# Altium project DAC_IO.PrjPcb
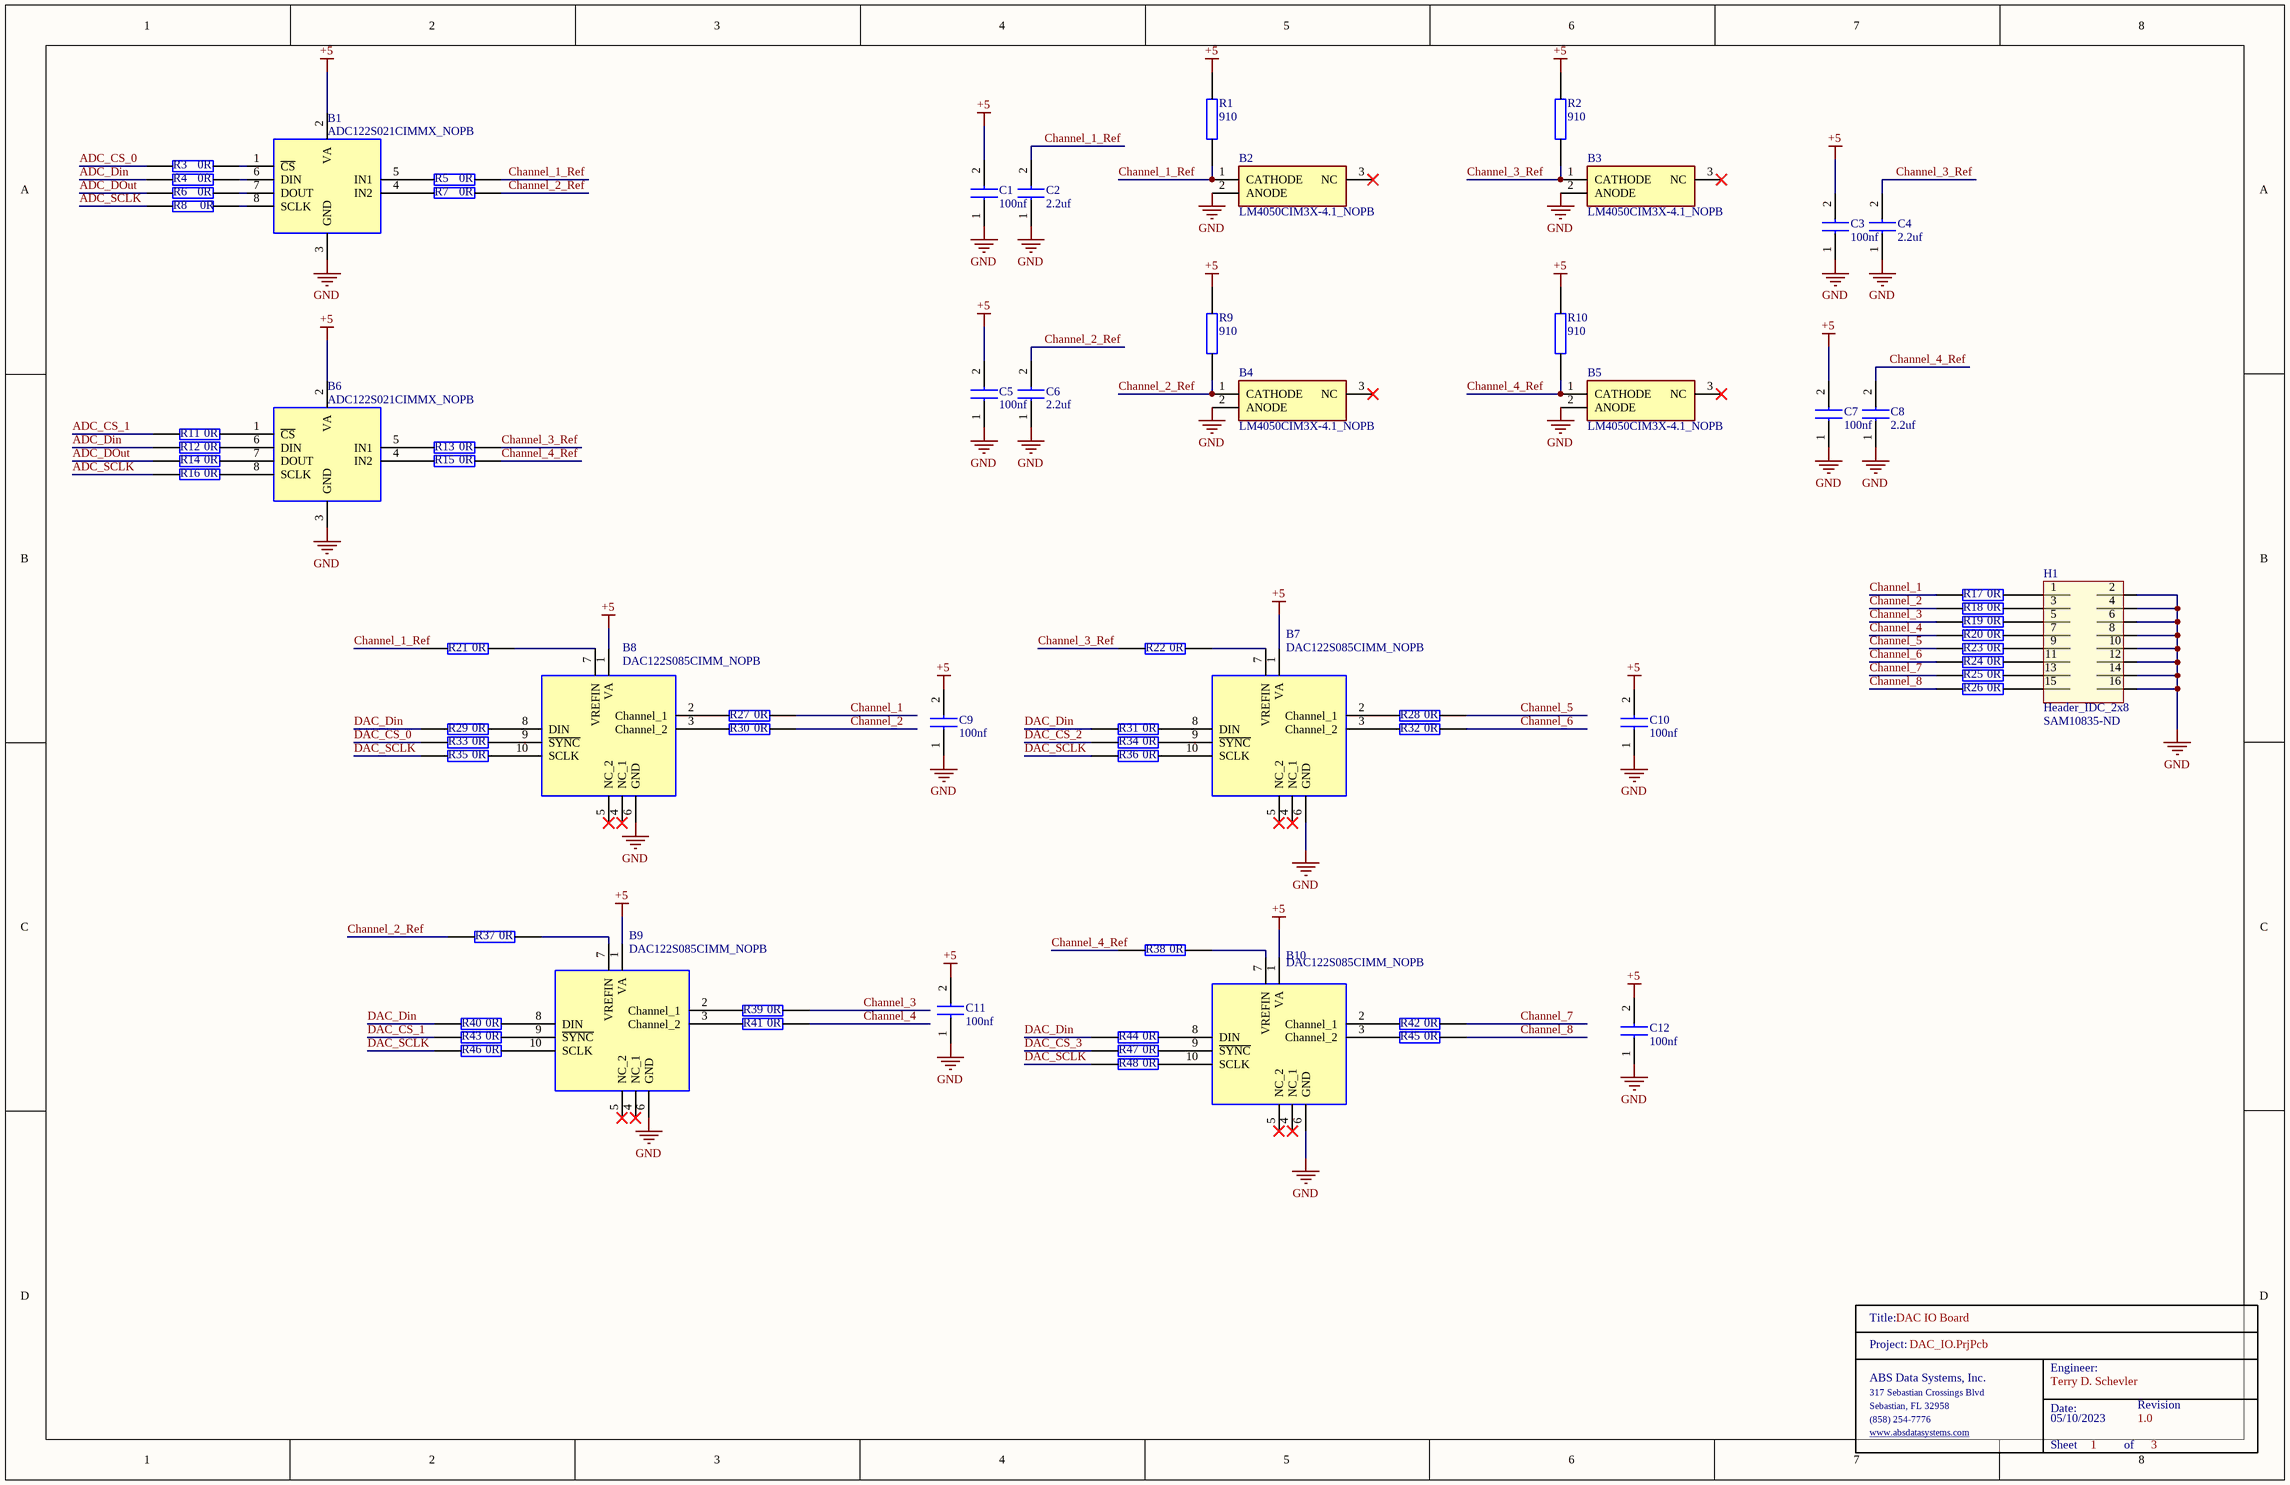
[diagram p0: DAC_IO.SchDoc]
3 sheets, 220 parts. Net scope: global (net labels, ports and power ports of the same name join across sheets).
Board file: DAC_PCB.PcbDoc
Sheets:
  DAC_IO.SchDoc
  DAC_CPU.SchDoc
  DAC_LED_Monitor.SchDoc

## Sheet DAC_IO.SchDoc: DAC IO Board
size Tabloid; Date: 05/10/2023; Engineer: Terry D. Schevler; Revision: 1.0; SheetNumber: 1; SheetTotal: 3

### Parts
B1  ADC122S021CIMMX_NOPB  [SOP65P490X110-8N]
B2  LM4050CIM3X-4.1_NOPB  [SOT95P237X95-3N]
B3  LM4050CIM3X-4.1_NOPB  [SOT95P237X95-3N]
B4  LM4050CIM3X-4.1_NOPB  [SOT95P237X95-3N]
B5  LM4050CIM3X-4.1_NOPB  [SOT95P237X95-3N]
B6  ADC122S021CIMMX_NOPB  [SOP65P490X110-8N]
B7  DAC122S085CIMM_NOPB  [SOP50P490X110-10N]
B8  DAC122S085CIMM_NOPB  [SOP50P490X110-10N]
B9  DAC122S085CIMM_NOPB  [SOP50P490X110-10N]
B10  DAC122S085CIMM_NOPB  [SOP50P490X110-10N]
C1  100nf  [0603]
C2  2.2uf  [0603]
C3  100nf  [0603]
C4  2.2uf  [0603]
C5  100nf  [0603]
C6  2.2uf  [0603]
C7  100nf  [0603]
C8  2.2uf  [0603]
C9  100nf  [0603]
C10  100nf  [0603]
C11  100nf  [0603]
C12  100nf  [0603]
H1  Header_IDC_2x8  Supplier Part Number 1: SAM10835-ND  [HEADER16]
R1  910  [0603]
R2  910  [0603]
R3  0R  [0603]
R4  0R  [0603]
R5  0R  [0603]
R6  0R  [0603]
R7  0R  [0603]
R8  0R  [0603]
R9  910  [0603]
R10  910  [0603]
R11  0R  [0603]
R12  0R  [0603]
R13  0R  [0603]
R14  0R  [0603]
R15  0R  [0603]
R16  0R  [0603]
R17  0R  [0603]
R18  0R  [0603]
R19  0R  [0603]
R20  0R  [0603]
R21  0R  [0603]
R22  0R  [0603]
R23  0R  [0603]
R24  0R  [0603]
R25  0R  [0603]
R26  0R  [0603]
R27  0R  [0603]
R28  0R  [0603]
R29  0R  [0603]
R30  0R  [0603]
R31  0R  [0603]
R32  0R  [0603]
R33  0R  [0603]
R34  0R  [0603]
R35  0R  [0603]
R36  0R  [0603]
R37  0R  [0603]
R38  0R  [0603]
R39  0R  [0603]
R40  0R  [0603]
R41  0R  [0603]
R42  0R  [0603]
R43  0R  [0603]
R44  0R  [0603]
R45  0R  [0603]
R46  0R  [0603]
R47  0R  [0603]
R48  0R  [0603]
TitleBlock_1  TitleBlock  (value not drawn)  (graphical)

### Nets
+5: B1.2(VA) B6.2(VA) B7.1(VA) B8.1(VA) B9.1(VA) B10.1(VA) C1.2 C3.2 C5.2 C7.2 C9.2 C10.2 C11.2 C12.2 R1.1 R2.1 R9.1 R10.1
GND: B1.3(GND) B2.2(ANODE) B3.2(ANODE) B4.2(ANODE) B5.2(ANODE) B6.3(GND) B7.6(GND) B8.6(GND) B9.6(GND) B10.6(GND) C1.1 C2.1 C3.1 C4.1 C5.1 C6.1 C7.1 C8.1 C9.1 C10.1 C11.1 C12.1 H1.2 H1.4 H1.6 H1.8 H1.10 H1.12 H1.14 H1.16
ADC_CS_0: R3.1
ADC_CS_1: R11.1
ADC_Din: R4.1 R12.1
ADC_DOut: R6.1 R14.1
ADC_SCLK: R8.1 R16.1
Channel_1: R17.1 R27.2
Channel_1_Ref: B2.1(CATHODE) C2.2 R1.2 R5.2 R21.1
Channel_2: R18.1 R30.2
Channel_2_Ref: B4.1(CATHODE) C6.2 R7.2 R9.2 R37.1
Channel_3: R19.1 R39.2
Channel_3_Ref: B3.1(CATHODE) C4.2 R2.2 R13.2 R22.1
Channel_4: R20.1 R41.2
Channel_4_Ref: B5.1(CATHODE) C8.2 R10.2 R15.2 R38.1
Channel_5: R23.1 R28.2
Channel_6: R24.1 R32.2
Channel_7: R25.1 R42.2
Channel_8: R26.1 R45.2
DAC_CS_0: R33.1
DAC_CS_1: R43.1
DAC_CS_2: R34.1
DAC_CS_3: R47.1
DAC_Din: R29.1 R31.1 R40.1 R44.1
DAC_SCLK: R35.1 R36.1 R46.1 R48.1
NetB1_1: B1.1(~{CS}) R3.2
NetB1_4: B1.4(IN2) R7.1
NetB1_5: B1.5(IN1) R5.1
NetB1_6: B1.6(DIN) R4.2
NetB1_7: B1.7(DOUT) R6.2
NetB1_8: B1.8(SCLK) R8.2
NetB6_1: B6.1(~{CS}) R11.2
NetB6_4: B6.4(IN2) R15.1
NetB6_5: B6.5(IN1) R13.1
NetB6_6: B6.6(DIN) R12.2
NetB6_7: B6.7(DOUT) R14.2
NetB6_8: B6.8(SCLK) R16.2
NetB7_2: B7.2(Channel_1) R28.1
NetB7_3: B7.3(Channel_2) R32.1
NetB7_7: B7.7(VREFIN) R22.2
NetB7_8: B7.8(DIN) R31.2
NetB7_9: B7.9(~{SYNC}) R34.2
NetB7_10: B7.10(SCLK) R36.2
NetB8_2: B8.2(Channel_1) R27.1
NetB8_3: B8.3(Channel_2) R30.1
NetB8_7: B8.7(VREFIN) R21.2
NetB8_8: B8.8(DIN) R29.2
NetB8_9: B8.9(~{SYNC}) R33.2
NetB8_10: B8.10(SCLK) R35.2
NetB9_2: B9.2(Channel_1) R39.1
NetB9_3: B9.3(Channel_2) R41.1
NetB9_7: B9.7(VREFIN) R37.2
NetB9_8: B9.8(DIN) R40.2
NetB9_9: B9.9(~{SYNC}) R43.2
NetB9_10: B9.10(SCLK) R46.2
NetB10_2: B10.2(Channel_1) R42.1
NetB10_3: B10.3(Channel_2) R45.1
NetB10_7: B10.7(VREFIN) R38.2
NetB10_8: B10.8(DIN) R44.2
NetB10_9: B10.9(~{SYNC}) R47.2
NetB10_10: B10.10(SCLK) R48.2
NetH1_1: H1.1 R17.2
NetH1_3: H1.3 R18.2
NetH1_5: H1.5 R19.2
NetH1_7: H1.7 R20.2
NetH1_9: H1.9 R23.2
NetH1_11: H1.11 R24.2
NetH1_13: H1.13 R25.2
NetH1_15: H1.15 R26.2

Not connected (* = marked no-connect by the designer): B2 3(NC)*; B3 3(NC)*; B4 3(NC)*; B5 3(NC)*; B7 4(NC_1)* 5(NC_2)*; B8 4(NC_1)* 5(NC_2)*; B9 4(NC_1)* 5(NC_2)*; B10 4(NC_1)* 5(NC_2)*

### Notes on the sheet
- (in symbol TitleBlock) Title:; Project:; Engineer:; ABS Data Systems, Inc.; 317 Sebastian Crossings Blvd; Sebastian, FL 32958; Date:; Revision; (858) 254-7776; www.absdatasystems.com; Sheet; of

### Library data of the parts
B1 B6 = ADC122S021CIMMX_NOPB: 2 Channel, 50 ksps to 200 ksps 12-Bit A/D Converter; Manufacturer_Name: Texas Instruments; Manufacturer_Part_Number: ADC122S021CIMMX/NOPB; Geometry.Height: 1.1mm; Mouser Part Number: 926-A122S021CIMMXNPB; Mouser Price/Stock: https://www.mouser.co.uk/ProductDetail/Texas-Instruments/ADC122S021CIMMX-NOPB/?qs=7X5t%252BdzoRHB2bC7Teu8H3A%3D%3D; Datasheet Link: http://www.ti.com/lit/gpn/ADC122S021
B2-B5 = LM4050CIM3X-4.1_NOPB: 50ppm/C Precision Micropower Shunt Voltage Reference; Manufacturer_Name: Texas Instruments; Manufacturer_Part_Number: LM4050CIM3X-4.1/NOPB; Geometry.Height: 0.95mm; Mouser Part Number: 926-LM4050CIM3X41NPB; Mouser Price/Stock: https://www.mouser.co.uk/ProductDetail/Texas-Instruments/LM4050CIM3X-4.1-NOPB?qs=QbsRYf82W3Em%2F29oRlpByg%3D%3D; Datasheet Link: http://www.ti.com/lit/gpn/lm4050-n
B7-B10 = DAC122S085CIMM_NOPB: 12-Bit Micro Power DUAL Digital-to-Analog Converter with Rail-to-Rail Output; Manufacturer_Name: Texas Instruments; Manufacturer_Part_Number: DAC122S085CIMM/NOPB; Geometry.Height: 1.1mm; Mouser Part Number: 926-DAC122S085CIMMNO; Mouser Price/Stock: https://www.mouser.co.uk/ProductDetail/Texas-Instruments/DAC122S085CIMM-NOPB/?qs=7X5t%252BdzoRHCSswOz%252BE6yGA%3D%3D; Datasheet Link: http://www.ti.com/lit/gpn/dac122s085
C1 C3 C5 C7 C9-C12 = CL10B104JB8NNNC: Samsung Electro-Mechanics 0603 100nf
C2 C4 C6 C8 = CL10B225KP8NNNC: Samsung Electro-Mechanics 0603 2.2uf
H1 = Header_IDC_2x8: 16 Pin 2x8 Through Hold IDC Connector; Manufacturer: Samtec; Manufacturer Part Number: TST-108-01-G-D; Number of Contacts: 16; Gender: Male; Connector Type: Male Pin; Pitch: 2.54mm; Row Spacing: 0.1inch; Supplier 1: Digi-Key; RoHS: Yes; Category: Headers and Wire Housings; Stock 1: 227; Pricing 1: 1=2.85000, 10=2.73600, 100=2.28000, 500=1.93800, 1000=1.65300, 5000=1.48200 (USD); Mount: Through Hole; Contact Plating: Gold; Contact Material: Bronze; Housing Material: Polyester; Housing Color: Black; Color: Black; Min Operating Temperature: -55°C; Max Operating Temperature: 125°C; Number of Rows: 2; Termination: Solder; Packaging: Rail/Tube; Orientation: Straight; Number of Positions: 16; Length: 27.94mm; Depth: 9.27mm; Contact Mating Length: 0.25inch; REACH SVHC: No SVHC; ComponentLink1URL: https://datasheet.ciiva.com/739/tst-mkt-739845.pdf?src-supplier=Digi-Key; ComponentLink1Description: https://datasheet.ciiva.com/739/tst-mkt-739845.pdf?src-supplier=Digi-Key; ComponentLink2URL: https://datasheet.ciiva.com/10018/htst-10018510.pdf?src-supplier=Avnet; ComponentLink2Description: https://datasheet.ciiva.com/10018/htst-10018510.pdf?src-supplier=Avnet
R1 R2 R9 R10 = RT0603BRC07910RL: YAGEO 0603 910 ohm; Manufacturer_Name: KEMET; Manufacturer_Part_Number: RC0603JR-070RL; Geometry.Height: 0.55mm; Mouser Part Number: 603-RC0603JR-070RL; Mouser Price/Stock: https://www.mouser.co.uk/ProductDetail/YAGEO/RC0603JR-070RL?qs=2cAdsCoAWRGWyPcuXgGiXQ%3D%3D; Datasheet Link: https://datasheet.datasheetarchive.com/originals/distributors/Datasheets_SAMA/902f9e387b938f871d31120f5fc1d65e.pdf
R3-R8 R11-R48 = RC0603JR-070RL: YAGEO 0603 0 ohm; Manufacturer_Name: KEMET; Geometry.Height: 0.55mm; Mouser Part Number: 603-RC0603JR-070RL; Mouser Price/Stock: https://www.mouser.co.uk/ProductDetail/YAGEO/RC0603JR-070RL?qs=2cAdsCoAWRGWyPcuXgGiXQ%3D%3D; Manufacturer_Part_Number: RC0603JR-070RL; Datasheet Link: https://datasheet.datasheetarchive.com/originals/distributors/Datasheets_SAMA/902f9e387b938f871d31120f5fc1d65e.pdf

## Sheet DAC_CPU.SchDoc: DAC CPU Board
size Tabloid; Date: 06/07/2023; Engineer: Terry D. Schevker; Revision: 1.0; SheetNumber: 2; SheetTotal: 3
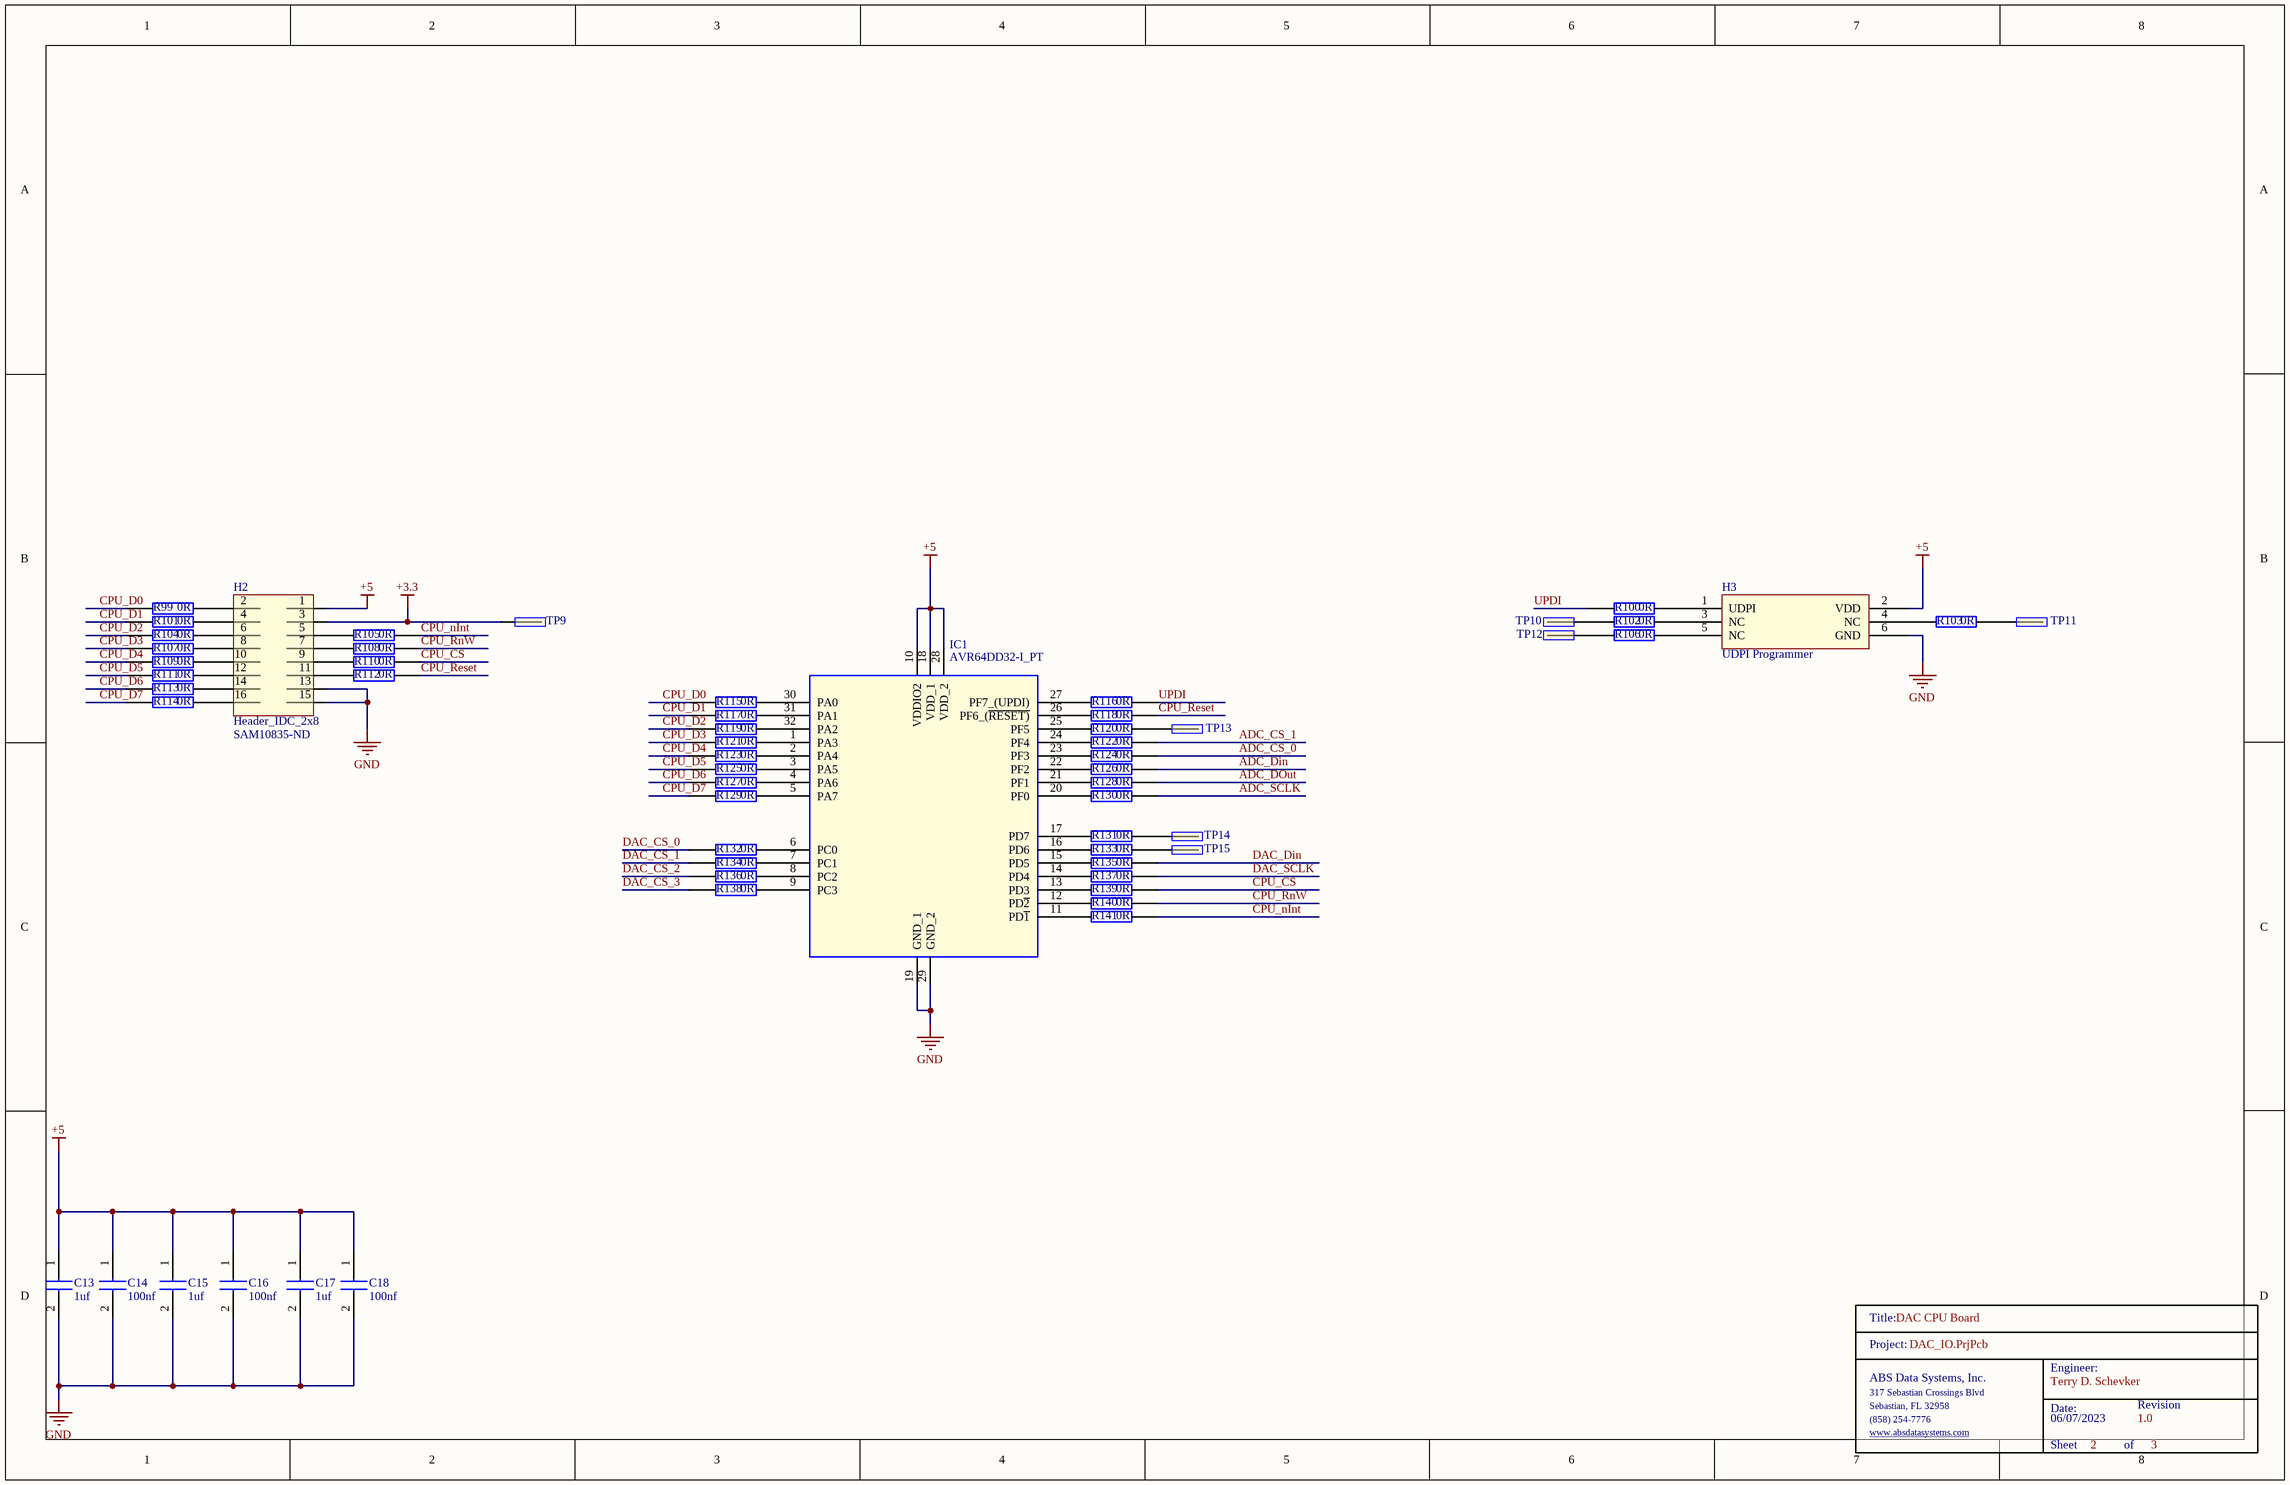
[diagram p1: DAC_CPU.SchDoc]

### Parts
C13  1uf  [0603]
C14  100nf  [0603]
C15  1uf  [0603]
C16  100nf  [0603]
C17  1uf  [0603]
C18  100nf  [0603]
H2  Header_IDC_2x8  Supplier Part Number 1: SAM10835-ND  [HEADER16]
H3  UDPI Programmer  [HDR2X3]
IC1  AVR64DD32-I_PT  [QFP80P900X900X120-32N]
R99  0R  [0603]
R100  0R  [0603]
R101  0R  [0603]
R102  0R  [0603]
R103  0R  [0603]
R104  0R  [0603]
R105  0R  [0603]
R106  0R  [0603]
R107  0R  [0603]
R108  0R  [0603]
R109  0R  [0603]
R110  0R  [0603]
R111  0R  [0603]
R112  0R  [0603]
R113  0R  [0603]
R114  0R  [0603]
R115  0R  [0603]
R116  0R  [0603]
R117  0R  [0603]
R118  0R  [0603]
R119  0R  [0603]
R120  0R  [0603]
R121  0R  [0603]
R122  0R  [0603]
R123  0R  [0603]
R124  0R  [0603]
R125  0R  [0603]
R126  0R  [0603]
R127  0R  [0603]
R128  0R  [0603]
R129  0R  [0603]
R130  0R  [0603]
R131  0R  [0603]
R132  0R  [0603]
R133  0R  [0603]
R134  0R  [0603]
R135  0R  [0603]
R136  0R  [0603]
R137  0R  [0603]
R138  0R  [0603]
R139  0R  [0603]
R140  0R  [0603]
R141  0R  [0603]
TitleBlock_?  TitleBlock  (value not drawn)  (graphical)
TP9  TP  [TP]  (value not drawn)
TP10  TP  [TP]  (value not drawn)
TP11  TP  [TP]  (value not drawn)
TP12  TP  [TP]  (value not drawn)
TP13  TP  [TP]  (value not drawn)
TP14  TP  [TP]  (value not drawn)
TP15  TP  [TP]  (value not drawn)

### Nets
+3.3: H2.3 TP9.1
+5: C13.1 C14.1 C15.1 C16.1 C17.1 C18.1 H2.1 H3.2(VDD) IC1.10(VDDIO2) IC1.18(VDD_1) IC1.28(VDD_2)
GND: C13.2 C14.2 C15.2 C16.2 C17.2 C18.2 H2.13 H2.15 H3.6(GND) IC1.19(GND_1) IC1.29(GND_2)
ADC_CS_0: R124.2
ADC_CS_1: R122.2
ADC_Din: R126.2
ADC_DOut: R128.2
ADC_SCLK: R130.2
CPU_CS: R110.2 R139.2
CPU_D0: R99.1 R115.1
CPU_D1: R101.1 R117.1
CPU_D2: R104.1 R119.1
CPU_D3: R107.1 R121.1
CPU_D4: R109.1 R123.1
CPU_D5: R111.1 R125.1
CPU_D6: R113.1 R127.1
CPU_D7: R114.1 R129.1
CPU_nInt: R105.2 R141.2
CPU_Reset: R112.2 R118.2
CPU_RnW: R108.2 R140.2
DAC_CS_0: R132.1
DAC_CS_1: R134.1
DAC_CS_2: R136.1
DAC_CS_3: R138.1
DAC_Din: R135.2
DAC_SCLK: R137.2
UPDI: R100.1 R116.2
NetH2_2: H2.2 R99.2
NetH2_4: H2.4 R101.2
NetH2_5: H2.5 R105.1
NetH2_6: H2.6 R104.2
NetH2_7: H2.7 R108.1
NetH2_8: H2.8 R107.2
NetH2_9: H2.9 R110.1
NetH2_10: H2.10 R109.2
NetH2_11: H2.11 R112.1
NetH2_12: H2.12 R111.2
NetH2_14: H2.14 R113.2
NetH2_16: H2.16 R114.2
NetH3_1: H3.1(UDPI) R100.2
NetH3_3: H3.3(NC) R102.2
NetH3_4: H3.4(NC) R103.1
NetH3_5: H3.5(NC) R106.2
NetIC1_1: IC1.1(PA3) R121.2
NetIC1_2: IC1.2(PA4) R123.2
NetIC1_3: IC1.3(PA5) R125.2
NetIC1_4: IC1.4(PA6) R127.2
NetIC1_5: IC1.5(PA7) R129.2
NetIC1_6: IC1.6(PC0) R132.2
NetIC1_7: IC1.7(PC1) R134.2
NetIC1_8: IC1.8(PC2) R136.2
NetIC1_9: IC1.9(PC3) R138.2
NetIC1_11: IC1.11(PD~{1}) R141.1
NetIC1_12: IC1.12(PD~{2}) R140.1
NetIC1_13: IC1.13(PD3) R139.1
NetIC1_14: IC1.14(PD4) R137.1
NetIC1_15: IC1.15(PD5) R135.1
NetIC1_16: IC1.16(PD6) R133.1
NetIC1_17: IC1.17(PD7) R131.1
NetIC1_20: IC1.20(PF0) R130.1
NetIC1_21: IC1.21(PF1) R128.1
NetIC1_22: IC1.22(PF2) R126.1
NetIC1_23: IC1.23(PF3) R124.1
NetIC1_24: IC1.24(PF4) R122.1
NetIC1_25: IC1.25(PF5) R120.1
NetIC1_26: IC1.26(PF6_(~{RESET)}) R118.1
NetIC1_27: IC1.27(PF7_(UPDI)) R116.1
NetIC1_30: IC1.30(PA0) R115.2
NetIC1_31: IC1.31(PA1) R117.2
NetIC1_32: IC1.32(PA2) R119.2
NetR102_1: R102.1 TP10.1
NetR103_2: R103.2 TP11.1
NetR106_1: R106.1 TP12.1
NetR120_2: R120.2 TP13.1
NetR131_2: R131.2 TP14.1
NetR133_2: R133.2 TP15.1

### Notes on the sheet
- (in symbol TitleBlock) Title:; Project:; Engineer:; ABS Data Systems, Inc.; 317 Sebastian Crossings Blvd; Sebastian, FL 32958; Date:; Revision; (858) 254-7776; www.absdatasystems.com; Sheet; of

### Library data of the parts
C13 C15 C17 = CL10B105KA8NNNL: Samsung Electro-Mechanics 0603 1uf
C14 C16 C18 = CL10B104JB8NNNC: Samsung Electro-Mechanics 0603 100nf
H2 = Header_IDC_2x8: as H1 on sheet DAC_IO; Supplier 1: Digi-Key; RoHS: Yes; Category: Headers and Wire Housings; Stock 1: 227; Pricing 1: 1=2.85000, 10=2.73600, 100=2.28000, 500=1.93800, 1000=1.65300, 5000=1.48200 (USD); Mount: Through Hole; Contact Plating: Gold; Contact Material: Bronze; Housing Material: Polyester; Housing Color: Black; Color: Black; Min Operating Temperature: -55°C; Max Operating Temperature: 125°C; Number of Rows: 2; Termination: Solder; Packaging: Rail/Tube; Orientation: Straight; Number of Positions: 16; Length: 27.94mm; Depth: 9.27mm; Contact Mating Length: 0.25inch; REACH SVHC: No SVHC; ComponentLink1URL: https://datasheet.ciiva.com/739/tst-mkt-739845.pdf?src-supplier=Digi-Key; ComponentLink1Description: https://datasheet.ciiva.com/739/tst-mkt-739845.pdf?src-supplier=Digi-Key; ComponentLink2URL: https://datasheet.ciiva.com/10018/htst-10018510.pdf?src-supplier=Avnet; ComponentLink2Description: https://datasheet.ciiva.com/10018/htst-10018510.pdf?src-supplier=Avnet
H3 = UDPI Programmer: 6 Pin 2X3 Through Hole Header
IC1 = AVR64DD32-I_PT: Integrated Circuit; Manufacturer_Name: Microchip; Manufacturer_Part_Number: AVR64DD32-I/PT | MULTI-VOLTAGE I/O; Datasheet Link: https://www.microchip.com/en-us/product/AVR64DD32; Height: 1.2mm
R99-R141 = RC0603JR-070RL: as R3 on sheet DAC_IO; Mouser Part Number: 603-RC0603JR-070RL; Mouser Price/Stock: https://www.mouser.co.uk/ProductDetail/YAGEO/RC0603JR-070RL?qs=2cAdsCoAWRGWyPcuXgGiXQ%3D%3D; Manufacturer_Part_Number: RC0603JR-070RL; Datasheet Link: https://datasheet.datasheetarchive.com/originals/distributors/Datasheets_SAMA/902f9e387b938f871d31120f5fc1d65e.pdf
TP9-TP15 = TP: Manufacturer: Samtec; Manufacturer Part Number: TST-105-01-G-D; Number of Contacts: 16; Gender: Male; Connector Type: Male Pin; Pitch: 2.54mm; Row Spacing: 0.1inch; Supplier 1: Digi-Key; RoHS: Yes; Category: Headers and Wire Housings; Stock 1: 227; Pricing 1: 1=2.85000, 10=2.73600, 100=2.28000, 500=1.93800, 1000=1.65300, 5000=1.48200 (USD); Mount: Through Hole; Contact Plating: Gold; Contact Material: Bronze; Housing Material: Polyester; Housing Color: Black; Color: Black; Min Operating Temperature: -55°C; Max Operating Temperature: 125°C; Number of Rows: 2; Termination: Solder; Packaging: Rail/Tube; Orientation: Straight; Number of Positions: 16; Length: 27.94mm; Depth: 9.27mm; Contact Mating Length: 0.25inch; REACH SVHC: No SVHC; ComponentLink1URL: https://datasheet.ciiva.com/739/tst-mkt-739845.pdf?src-supplier=Digi-Key; ComponentLink1Description: https://datasheet.ciiva.com/739/tst-mkt-739845.pdf?src-supplier=Digi-Key; ComponentLink2URL: https://datasheet.ciiva.com/10018/htst-10018510.pdf?src-supplier=Avnet; ComponentLink2Description: https://datasheet.ciiva.com/10018/htst-10018510.pdf?src-supplier=Avnet

## Sheet DAC_LED_Monitor.SchDoc: DAC LED Monitor
size Tabloid; Date: 05/10/2023; Engineer: Terry D.  Schevker; Revision: 1.0; SheetNumber: 3; SheetTotal: 3
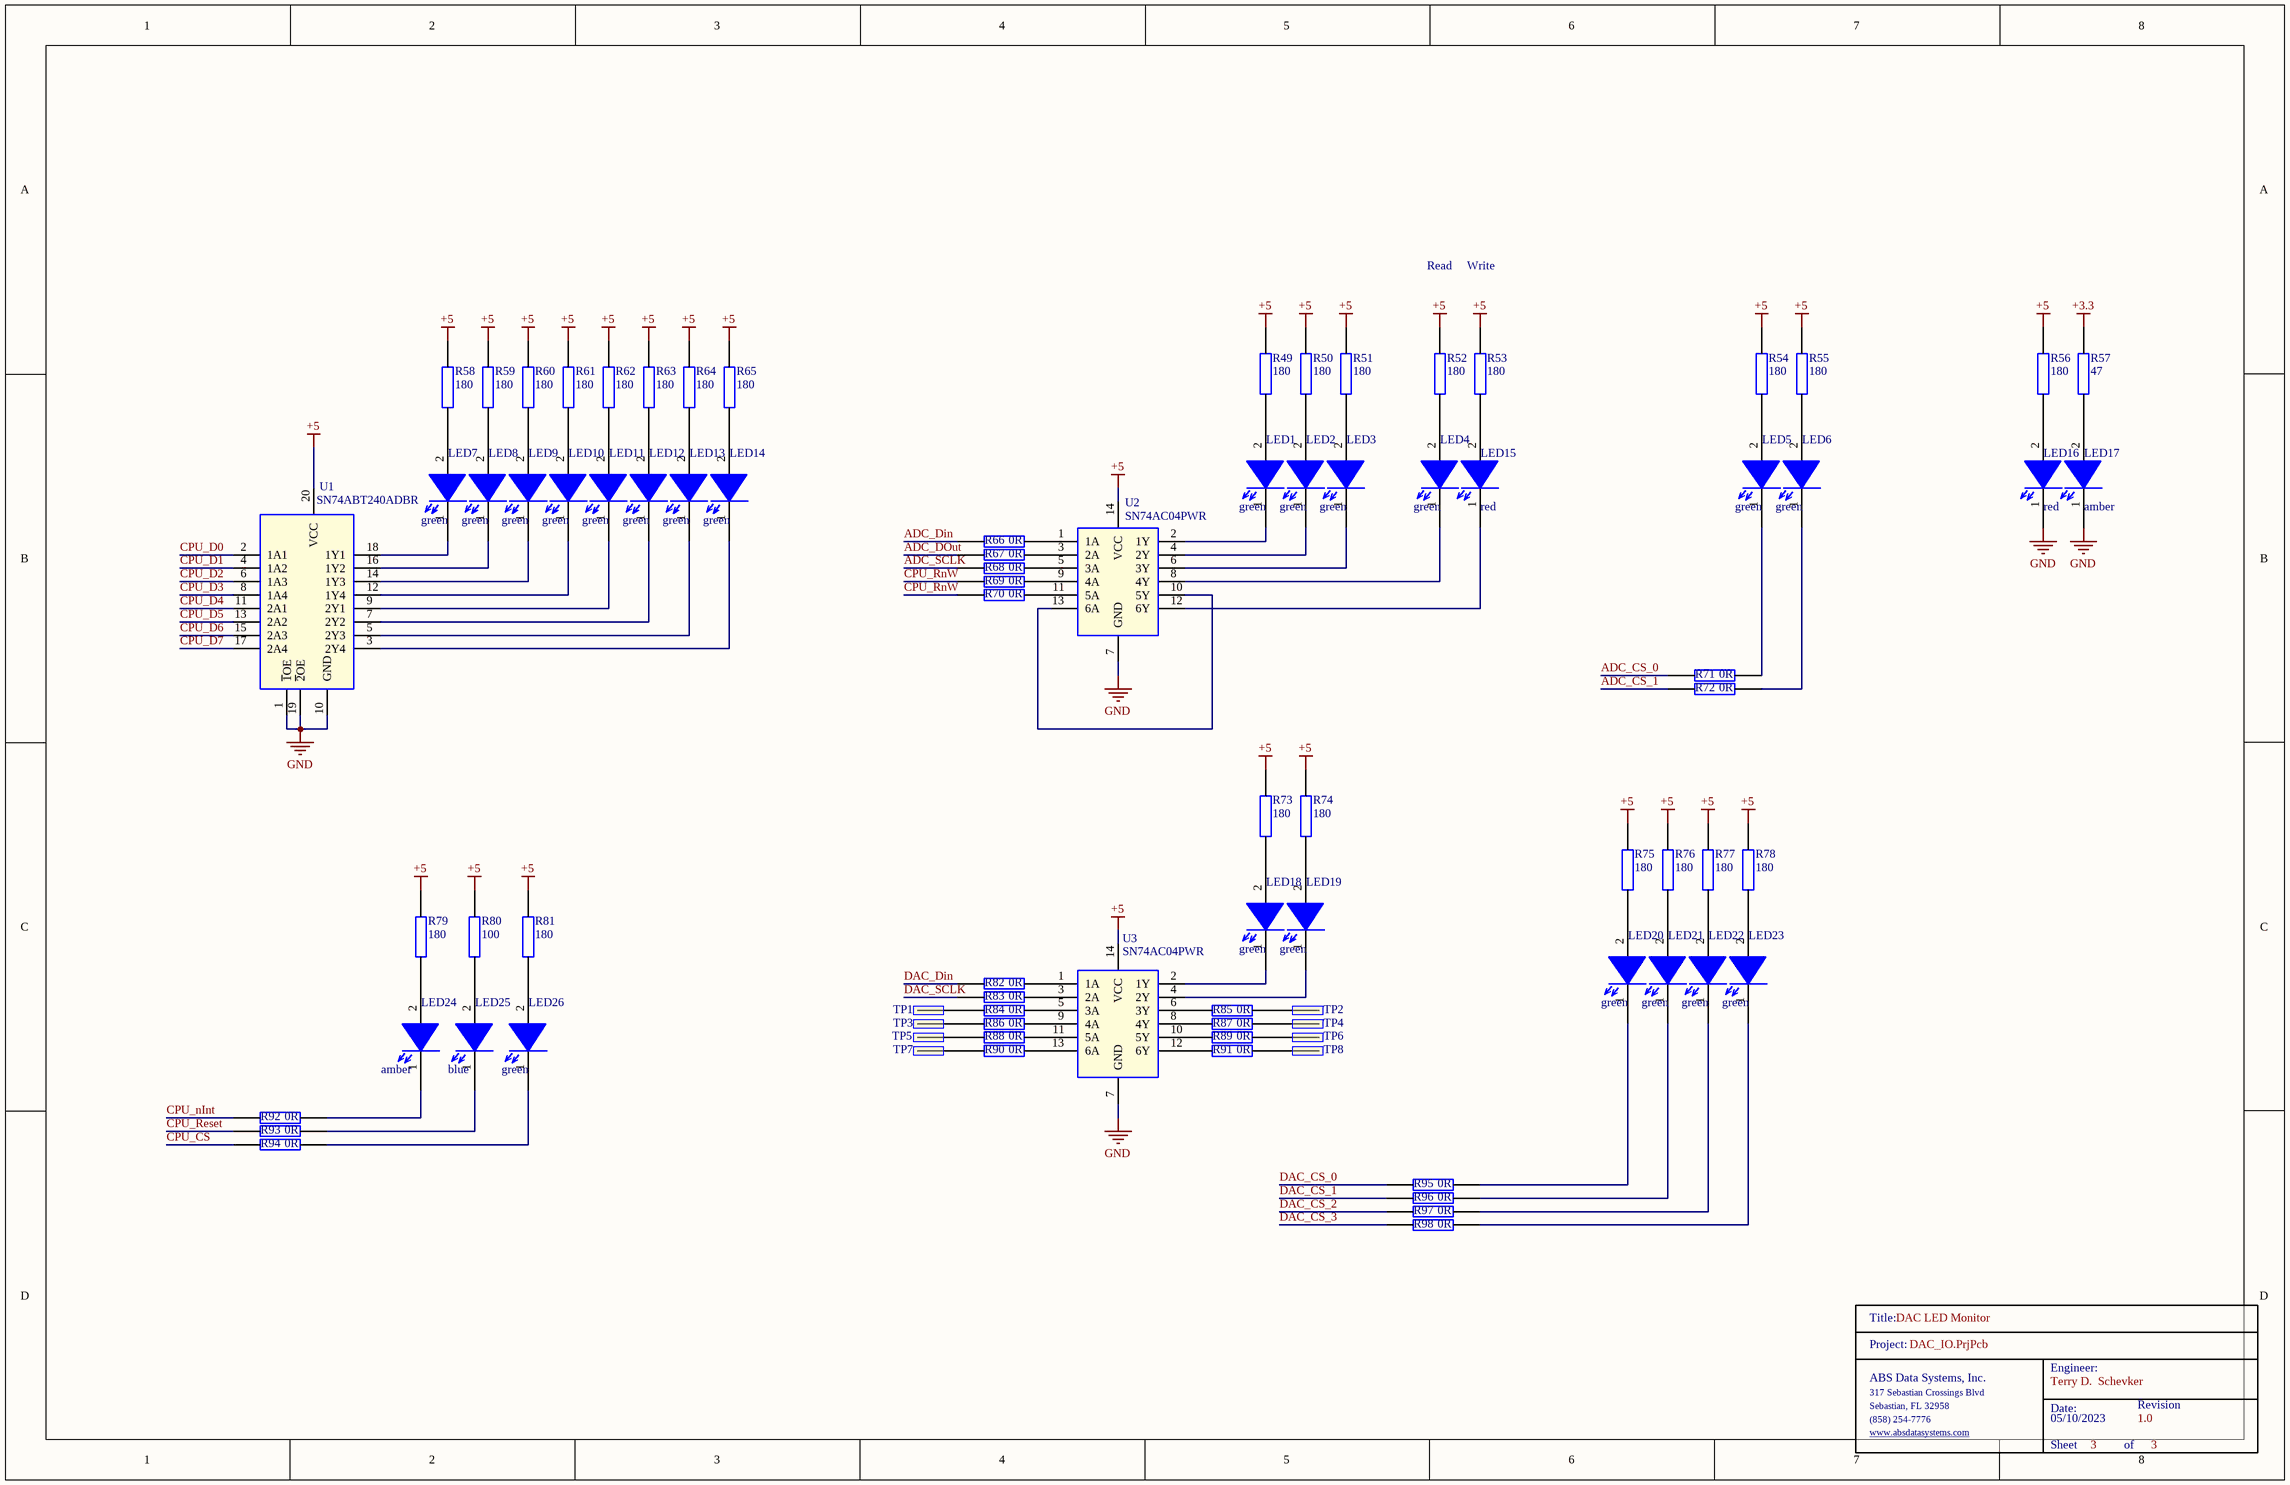
[diagram p2: DAC_LED_Monitor.SchDoc]

### Parts
LED1  green  [0603_Diode]
LED2  green  [0603_Diode]
LED3  green  [0603_Diode]
LED4  green  [0603_Diode]
LED5  green  [0603_Diode]
LED6  green  [0603_Diode]
LED7  green  [0603_Diode]
LED8  green  [0603_Diode]
LED9  green  [0603_Diode]
LED10  green  [0603_Diode]
LED11  green  [0603_Diode]
LED12  green  [0603_Diode]
LED13  green  [0603_Diode]
LED14  green  [0603_Diode]
LED15  red  [0603_Diode]
LED16  red  [0603_Diode]
LED17  amber  [0603_Diode]
LED18  green  [0603_Diode]
LED19  green  [0603_Diode]
LED20  green  [0603_Diode]
LED21  green  [0603_Diode]
LED22  green  [0603_Diode]
LED23  green  [0603_Diode]
LED24  amber  [0603_Diode]
LED25  blue  [0603_Diode]
LED26  green  [0603_Diode]
R49  180  [0603]
R50  180  [0603]
R51  180  [0603]
R52  180  [0603]
R53  180  [0603]
R54  180  [0603]
R55  180  [0603]
R56  180  [0603]
R57  47  [0603]
R58  180  [0603]
R59  180  [0603]
R60  180  [0603]
R61  180  [0603]
R62  180  [0603]
R63  180  [0603]
R64  180  [0603]
R65  180  [0603]
R66  0R  [0603]
R67  0R  [0603]
R68  0R  [0603]
R69  0R  [0603]
R70  0R  [0603]
R71  0R  [0603]
R72  0R  [0603]
R73  180  [0603]
R74  180  [0603]
R75  180  [0603]
R76  180  [0603]
R77  180  [0603]
R78  180  [0603]
R79  180  [0603]
R80  100  [0603]
R81  180  [0603]
R82  0R  [0603]
R83  0R  [0603]
R84  0R  [0603]
R85  0R  [0603]
R86  0R  [0603]
R87  0R  [0603]
R88  0R  [0603]
R89  0R  [0603]
R90  0R  [0603]
R91  0R  [0603]
R92  0R  [0603]
R93  0R  [0603]
R94  0R  [0603]
R95  0R  [0603]
R96  0R  [0603]
R97  0R  [0603]
R98  0R  [0603]
TitleBlock_2  TitleBlock  (value not drawn)  (graphical)
TP1  TP  [TP]  (value not drawn)
TP2  TP  [TP]  (value not drawn)
TP3  TP  [TP]  (value not drawn)
TP4  TP  [TP]  (value not drawn)
TP5  TP  [TP]  (value not drawn)
TP6  TP  [TP]  (value not drawn)
TP7  TP  [TP]  (value not drawn)
TP8  TP  [TP]  (value not drawn)
U1  SN74ABT240ADBR  [SOP65P780X200-20N]
U2  SN74AC04PWR  [SOP65P640X120-14N]
U3  SN74AC04PWR  [SOP65P640X120-14N]

### Nets
+3.3: R57.1
+5: R49.2 R50.2 R51.2 R52.2 R53.2 R54.2 R55.2 R56.2 R58.2 R59.2 R60.2 R61.2 R62.2 R63.2 R64.2 R65.2 R73.2 R74.2 R75.2 R76.2 R77.2 R78.2 R79.2 R80.1 R81.2 U1.20(VCC) U2.14(VCC) U3.14(VCC)
GND: LED16.1(K) LED17.1(K) U1.1(~{1}OE) U1.10(GND) U1.19(~{2}OE) U2.7(GND) U3.7(GND)
ADC_CS_0: R71.1
ADC_CS_1: R72.1
ADC_Din: R66.1
ADC_DOut: R67.1
ADC_SCLK: R68.1
CPU_CS: R94.1
CPU_D0: U1.2(1A1)
CPU_D1: U1.4(1A2)
CPU_D2: U1.6(1A3)
CPU_D3: U1.8(1A4)
CPU_D4: U1.11(2A1)
CPU_D5: U1.13(2A2)
CPU_D6: U1.15(2A3)
CPU_D7: U1.17(2A4)
CPU_nInt: R92.1
CPU_Reset: R93.1
CPU_RnW: R69.1 R70.1
DAC_CS_0: R95.1
DAC_CS_1: R96.1
DAC_CS_2: R97.1
DAC_CS_3: R98.1
DAC_Din: R82.1
DAC_SCLK: R83.1
NetLED1_1: LED1.1(K) U2.2(1Y)
NetLED1_2: LED1.2(A) R49.1
NetLED2_1: LED2.1(K) U2.4(2Y)
NetLED2_2: LED2.2(A) R50.1
NetLED3_1: LED3.1(K) U2.6(3Y)
NetLED3_2: LED3.2(A) R51.1
NetLED4_1: LED4.1(K) U2.8(4Y)
NetLED4_2: LED4.2(A) R52.1
NetLED5_1: LED5.1(K) R71.2
NetLED5_2: LED5.2(A) R54.1
NetLED6_1: LED6.1(K) R72.2
NetLED6_2: LED6.2(A) R55.1
NetLED7_1: LED7.1(K) U1.18(1Y1)
NetLED7_2: LED7.2(A) R58.1
NetLED8_1: LED8.1(K) U1.16(1Y2)
NetLED8_2: LED8.2(A) R59.1
NetLED9_1: LED9.1(K) U1.14(1Y3)
NetLED9_2: LED9.2(A) R60.1
NetLED10_1: LED10.1(K) U1.12(1Y4)
NetLED10_2: LED10.2(A) R61.1
NetLED11_1: LED11.1(K) U1.9(2Y1)
NetLED11_2: LED11.2(A) R62.1
NetLED12_1: LED12.1(K) U1.7(2Y2)
NetLED12_2: LED12.2(A) R63.1
NetLED13_1: LED13.1(K) U1.5(2Y3)
NetLED13_2: LED13.2(A) R64.1
NetLED14_1: LED14.1(K) U1.3(2Y4)
NetLED14_2: LED14.2(A) R65.1
NetLED15_1: LED15.1(K) U2.12(6Y)
NetLED15_2: LED15.2(A) R53.1
NetLED16_2: LED16.2(A) R56.1
NetLED17_2: LED17.2(A) R57.2
NetLED18_1: LED18.1(K) U3.2(1Y)
NetLED18_2: LED18.2(A) R73.1
NetLED19_1: LED19.1(K) U3.4(2Y)
NetLED19_2: LED19.2(A) R74.1
NetLED20_1: LED20.1(K) R95.2
NetLED20_2: LED20.2(A) R75.1
NetLED21_1: LED21.1(K) R96.2
NetLED21_2: LED21.2(A) R76.1
NetLED22_1: LED22.1(K) R97.2
NetLED22_2: LED22.2(A) R77.1
NetLED23_1: LED23.1(K) R98.2
NetLED23_2: LED23.2(A) R78.1
NetLED24_1: LED24.1(K) R92.2
NetLED24_2: LED24.2(A) R79.1
NetLED25_1: LED25.1(K) R93.2
NetLED25_2: LED25.2(A) R80.2
NetLED26_1: LED26.1(K) R94.2
NetLED26_2: LED26.2(A) R81.1
NetR66_2: R66.2 U2.1(1A)
NetR67_2: R67.2 U2.3(2A)
NetR68_2: R68.2 U2.5(3A)
NetR69_2: R69.2 U2.9(4A)
NetR70_2: R70.2 U2.11(5A)
NetR82_2: R82.2 U3.1(1A)
NetR83_2: R83.2 U3.3(2A)
NetR84_1: R84.1 TP1.1
NetR84_2: R84.2 U3.5(3A)
NetR85_1: R85.1 U3.6(3Y)
NetR85_2: R85.2 TP2.1
NetR86_1: R86.1 TP3.1
NetR86_2: R86.2 U3.9(4A)
NetR87_1: R87.1 U3.8(4Y)
NetR87_2: R87.2 TP4.1
NetR88_1: R88.1 TP5.1
NetR88_2: R88.2 U3.11(5A)
NetR89_1: R89.1 U3.10(5Y)
NetR89_2: R89.2 TP6.1
NetR90_1: R90.1 TP7.1
NetR90_2: R90.2 U3.13(6A)
NetR91_1: R91.1 U3.12(6Y)
NetR91_2: R91.2 TP8.1
NetU2_10: U2.10(5Y) U2.13(6A)

### Notes on the sheet
- Read
- Write
- (in symbol TitleBlock) Title:; Project:; Engineer:; ABS Data Systems, Inc.; 317 Sebastian Crossings Blvd; Sebastian, FL 32958; Date:; Revision; (858) 254-7776; www.absdatasystems.com; Sheet; of

### Library data of the parts
LED1-LED14 LED18-LED23 LED26 = 150060GS75000: Wurth Elektronik 0603 green; Manufacturer: Wurth Electronics; Wavelength: 520nm; Viewing Angle: 140°; Lens Style: Clear,Rectangular; Luminous Intensity: 430mcd; Forward Current: 30mA; Forward Voltage: 3.2V; Test Current: 20mA; Supplier 1: Digi-Key; Manufacturer Part Number: 150060GS75000; RoHS: Yes; Category: LEDs; Stock 1: 71509; Pricing 1: 1=0.14000, 50=0.13300, 100=0.11400, 500=0.09900 (USD); Mount: Surface Mount; Case/Package: 0603; Color: Green; Case Code (Metric): 1608; Case Code (Imperial): 0603; Min Operating Temperature: -40°C; Max Operating Temperature: 85°C; Package Quantity: 4000; Packaging: Tape and Reel; Dominant Wavelength: 520nm; Length: 1.6mm; Width: 0.8mm; Height: 0.7mm; REACH SVHC: Unknown; Lead Free: Lead Free; ComponentLink1URL: https://datasheet.ciiva.com/29562/150060gs75000-29562868.pdf?src-supplier=Digi-Key; ComponentLink1Description: https://datasheet.ciiva.com/29562/150060gs75000-29562868.pdf?src-supplier=Digi-Key; ComponentLink2URL: https://datasheet.ciiva.com/29279/759427-da-01-en-chipled-0603-w-kl-gruen-150060gs75000-29279201.pdf?src-supplier=Conrad; ComponentLink2Description: https://datasheet.ciiva.com/29279/759427-da-01-en-chipled-0603-w-kl-gruen-150060gs75000-29279201.pdf?src-supplier=Conrad; ComponentLink3URL: https://datasheet.ciiva.com/29562/150060gs75000-29562869.pdf?src-supplier=Digi-Key; ComponentLink3Description: https://datasheet.ciiva.com/29562/150060gs75000-29562869.pdf?src-supplier=Digi-Key; ComponentLink4URL: https://datasheet.ciiva.com/29562/150060gs75000-29562870.pdf?src-supplier=Digi-Key; ComponentLink4Description: https://datasheet.ciiva.com/29562/150060gs75000-29562870.pdf?src-supplier=Digi-Key
LED15 LED16 = 150060RS75000: Wurth Elektronik 0603 red; Manufacturer: Wurth Electronics; Manufacturer Part Number: 150060GS75000; Color: Green; Wavelength: 520nm; Viewing Angle: 140°; Lens Style: Clear,Rectangular; Luminous Intensity: 430mcd; Forward Current: 30mA; Forward Voltage: 3.2V; Test Current: 20mA; Supplier 1: Digi-Key; RoHS: Yes; Category: LEDs; Stock 1: 71509; Pricing 1: 1=0.14000, 50=0.13300, 100=0.11400, 500=0.09900 (USD); Mount: Surface Mount; Case/Package: 0603; Case Code (Metric): 1608; Case Code (Imperial): 0603; Min Operating Temperature: -40°C; Max Operating Temperature: 85°C; Package Quantity: 4000; Packaging: Tape and Reel; Dominant Wavelength: 520nm; Length: 1.6mm; Width: 0.8mm; Height: 0.7mm; REACH SVHC: Unknown; Lead Free: Lead Free; ComponentLink1URL: https://datasheet.ciiva.com/29562/150060gs75000-29562868.pdf?src-supplier=Digi-Key; ComponentLink1Description: https://datasheet.ciiva.com/29562/150060gs75000-29562868.pdf?src-supplier=Digi-Key; ComponentLink2URL: https://datasheet.ciiva.com/29279/759427-da-01-en-chipled-0603-w-kl-gruen-150060gs75000-29279201.pdf?src-supplier=Conrad; ComponentLink2Description: https://datasheet.ciiva.com/29279/759427-da-01-en-chipled-0603-w-kl-gruen-150060gs75000-29279201.pdf?src-supplier=Conrad; ComponentLink3URL: https://datasheet.ciiva.com/29562/150060gs75000-29562869.pdf?src-supplier=Digi-Key; ComponentLink3Description: https://datasheet.ciiva.com/29562/150060gs75000-29562869.pdf?src-supplier=Digi-Key; ComponentLink4URL: https://datasheet.ciiva.com/29562/150060gs75000-29562870.pdf?src-supplier=Digi-Key; ComponentLink4Description: https://datasheet.ciiva.com/29562/150060gs75000-29562870.pdf?src-supplier=Digi-Key
LED17 LED24 = 150060AS75000: Wurth Elektronik 0603 amber; Manufacturer: Wurth Electronics; Manufacturer Part Number: 150060GS75000; Color: Green; Wavelength: 520nm; Viewing Angle: 140°; Lens Style: Clear,Rectangular; Luminous Intensity: 430mcd; Forward Current: 30mA; Forward Voltage: 3.2V; Test Current: 20mA; Supplier 1: Digi-Key; RoHS: Yes; Category: LEDs; Stock 1: 71509; Pricing 1: 1=0.14000, 50=0.13300, 100=0.11400, 500=0.09900 (USD); Mount: Surface Mount; Case/Package: 0603; Case Code (Metric): 1608; Case Code (Imperial): 0603; Min Operating Temperature: -40°C; Max Operating Temperature: 85°C; Package Quantity: 4000; Packaging: Tape and Reel; Dominant Wavelength: 520nm; Length: 1.6mm; Width: 0.8mm; Height: 0.7mm; REACH SVHC: Unknown; Lead Free: Lead Free; ComponentLink1URL: https://datasheet.ciiva.com/29562/150060gs75000-29562868.pdf?src-supplier=Digi-Key; ComponentLink1Description: https://datasheet.ciiva.com/29562/150060gs75000-29562868.pdf?src-supplier=Digi-Key; ComponentLink2URL: https://datasheet.ciiva.com/29279/759427-da-01-en-chipled-0603-w-kl-gruen-150060gs75000-29279201.pdf?src-supplier=Conrad; ComponentLink2Description: https://datasheet.ciiva.com/29279/759427-da-01-en-chipled-0603-w-kl-gruen-150060gs75000-29279201.pdf?src-supplier=Conrad; ComponentLink3URL: https://datasheet.ciiva.com/29562/150060gs75000-29562869.pdf?src-supplier=Digi-Key; ComponentLink3Description: https://datasheet.ciiva.com/29562/150060gs75000-29562869.pdf?src-supplier=Digi-Key; ComponentLink4URL: https://datasheet.ciiva.com/29562/150060gs75000-29562870.pdf?src-supplier=Digi-Key; ComponentLink4Description: https://datasheet.ciiva.com/29562/150060gs75000-29562870.pdf?src-supplier=Digi-Key
LED25 = 150060BS75000: Wurth Elektronik 0603 blue; Manufacturer: Wurth Electronics; Manufacturer Part Number: 150060GS75000; Color: Green; Wavelength: 520nm; Viewing Angle: 140°; Lens Style: Clear,Rectangular; Luminous Intensity: 430mcd; Forward Current: 30mA; Forward Voltage: 3.2V; Test Current: 20mA; Supplier 1: Digi-Key; RoHS: Yes; Category: LEDs; Stock 1: 71509; Pricing 1: 1=0.14000, 50=0.13300, 100=0.11400, 500=0.09900 (USD); Mount: Surface Mount; Case/Package: 0603; Case Code (Metric): 1608; Case Code (Imperial): 0603; Min Operating Temperature: -40°C; Max Operating Temperature: 85°C; Package Quantity: 4000; Packaging: Tape and Reel; Dominant Wavelength: 520nm; Length: 1.6mm; Width: 0.8mm; Height: 0.7mm; REACH SVHC: Unknown; Lead Free: Lead Free; ComponentLink1URL: https://datasheet.ciiva.com/29562/150060gs75000-29562868.pdf?src-supplier=Digi-Key; ComponentLink1Description: https://datasheet.ciiva.com/29562/150060gs75000-29562868.pdf?src-supplier=Digi-Key; ComponentLink2URL: https://datasheet.ciiva.com/29279/759427-da-01-en-chipled-0603-w-kl-gruen-150060gs75000-29279201.pdf?src-supplier=Conrad; ComponentLink2Description: https://datasheet.ciiva.com/29279/759427-da-01-en-chipled-0603-w-kl-gruen-150060gs75000-29279201.pdf?src-supplier=Conrad; ComponentLink3URL: https://datasheet.ciiva.com/29562/150060gs75000-29562869.pdf?src-supplier=Digi-Key; ComponentLink3Description: https://datasheet.ciiva.com/29562/150060gs75000-29562869.pdf?src-supplier=Digi-Key; ComponentLink4URL: https://datasheet.ciiva.com/29562/150060gs75000-29562870.pdf?src-supplier=Digi-Key; ComponentLink4Description: https://datasheet.ciiva.com/29562/150060gs75000-29562870.pdf?src-supplier=Digi-Key
R49-R56 R58-R65 R73-R79 R81 = RC0603FR-13180RL: YAGEO 0603 180 ohm; Manufacturer_Name: KEMET; Manufacturer_Part_Number: RC0603JR-070RL; Geometry.Height: 0.55mm; Mouser Part Number: 603-RC0603JR-070RL; Mouser Price/Stock: https://www.mouser.co.uk/ProductDetail/YAGEO/RC0603JR-070RL?qs=2cAdsCoAWRGWyPcuXgGiXQ%3D%3D; Datasheet Link: https://datasheet.datasheetarchive.com/originals/distributors/Datasheets_SAMA/902f9e387b938f871d31120f5fc1d65e.pdf
R57 = RC0603FR-0747KL: YAGEO 0603 47; Manufacturer_Name: KEMET; Manufacturer_Part_Number: RC0603JR-070RL; Geometry.Height: 0.55mm; Mouser Part Number: 603-RC0603JR-070RL; Mouser Price/Stock: https://www.mouser.co.uk/ProductDetail/YAGEO/RC0603JR-070RL?qs=2cAdsCoAWRGWyPcuXgGiXQ%3D%3D; Datasheet Link: https://datasheet.datasheetarchive.com/originals/distributors/Datasheets_SAMA/902f9e387b938f871d31120f5fc1d65e.pdf
R66-R72 R82-R98 = RC0603JR-070RL: as R3 on sheet DAC_IO; Mouser Part Number: 603-RC0603JR-070RL; Mouser Price/Stock: https://www.mouser.co.uk/ProductDetail/YAGEO/RC0603JR-070RL?qs=2cAdsCoAWRGWyPcuXgGiXQ%3D%3D; Manufacturer_Part_Number: RC0603JR-070RL; Datasheet Link: https://datasheet.datasheetarchive.com/originals/distributors/Datasheets_SAMA/902f9e387b938f871d31120f5fc1d65e.pdf
R80 = RC0603FR-10100RL: YAGEO 0603 100 ohm; Manufacturer_Name: KEMET; Manufacturer_Part_Number: RC0603JR-070RL; Geometry.Height: 0.55mm; Mouser Part Number: 603-RC0603JR-070RL; Mouser Price/Stock: https://www.mouser.co.uk/ProductDetail/YAGEO/RC0603JR-070RL?qs=2cAdsCoAWRGWyPcuXgGiXQ%3D%3D; Datasheet Link: https://datasheet.datasheetarchive.com/originals/distributors/Datasheets_SAMA/902f9e387b938f871d31120f5fc1d65e.pdf
TP1-TP8 = TP: as TP9 on sheet DAC_CPU; Supplier 1: Digi-Key; RoHS: Yes; Category: Headers and Wire Housings; Stock 1: 227; Pricing 1: 1=2.85000, 10=2.73600, 100=2.28000, 500=1.93800, 1000=1.65300, 5000=1.48200 (USD); Mount: Through Hole; Contact Plating: Gold; Contact Material: Bronze; Housing Material: Polyester; Housing Color: Black; Color: Black; Min Operating Temperature: -55°C; Max Operating Temperature: 125°C; Number of Rows: 2; Termination: Solder; Packaging: Rail/Tube; Orientation: Straight; Number of Positions: 16; Length: 27.94mm; Depth: 9.27mm; Contact Mating Length: 0.25inch; REACH SVHC: No SVHC; ComponentLink1URL: https://datasheet.ciiva.com/739/tst-mkt-739845.pdf?src-supplier=Digi-Key; ComponentLink1Description: https://datasheet.ciiva.com/739/tst-mkt-739845.pdf?src-supplier=Digi-Key; ComponentLink2URL: https://datasheet.ciiva.com/10018/htst-10018510.pdf?src-supplier=Avnet; ComponentLink2Description: https://datasheet.ciiva.com/10018/htst-10018510.pdf?src-supplier=Avnet
U1 = SN74ABT240ADBR: Octal Buffers/Drivers With 3-State Outputs; Manufacturer_Name: Texas Instruments; Geometry.Height: 2mm; Mouser Part Number: 595-SN74ABT240ADBR; Mouser Price/Stock: https://www.mouser.co.uk/ProductDetail/Texas-Instruments/SN74ABT240ADBR?qs=JHHQeKcAU3Dt82k%252BVyiYdw%3D%3D; Manufacturer_Part_Number: SN74ABT240ADBR; Datasheet Link: http://www.ti.com/lit/gpn/sn74abt240a
U2 U3 = SN74AC04PWR: Hex Inverters; Manufacturer_Name: Texas Instruments; Geometry.Height: 1.2mm; Mouser Part Number: 595-SN74AC04PWR; Mouser Price/Stock: https://www.mouser.co.uk/ProductDetail/Texas-Instruments/SN74AC04PWR?qs=RZS%252BpEsUn7pRvPNqsga4SA%3D%3D; Manufacturer_Part_Number: SN74AC04PWR; Datasheet Link: http://www.ti.com/lit/gpn/sn74ac04

## Nets that join several sheets
+3.3: DAC_CPU (H2.3 TP9.1), DAC_LED_Monitor (R57.1)
+5: DAC_IO (18 pins), DAC_CPU (11 pins), DAC_LED_Monitor (28 pins)
GND: DAC_IO (30 pins), DAC_CPU (11 pins), DAC_LED_Monitor (7 pins)
ADC_CS_0: DAC_IO (R3.1), DAC_CPU (R124.2), DAC_LED_Monitor (R71.1)
ADC_CS_1: DAC_IO (R11.1), DAC_CPU (R122.2), DAC_LED_Monitor (R72.1)
ADC_Din: DAC_IO (R4.1 R12.1), DAC_CPU (R126.2), DAC_LED_Monitor (R66.1)
ADC_DOut: DAC_IO (R6.1 R14.1), DAC_CPU (R128.2), DAC_LED_Monitor (R67.1)
ADC_SCLK: DAC_IO (R8.1 R16.1), DAC_CPU (R130.2), DAC_LED_Monitor (R68.1)
CPU_CS: DAC_CPU (R110.2 R139.2), DAC_LED_Monitor (R94.1)
CPU_D0: DAC_CPU (R99.1 R115.1), DAC_LED_Monitor (U1.2)
CPU_D1: DAC_CPU (R101.1 R117.1), DAC_LED_Monitor (U1.4)
CPU_D2: DAC_CPU (R104.1 R119.1), DAC_LED_Monitor (U1.6)
CPU_D3: DAC_CPU (R107.1 R121.1), DAC_LED_Monitor (U1.8)
CPU_D4: DAC_CPU (R109.1 R123.1), DAC_LED_Monitor (U1.11)
CPU_D5: DAC_CPU (R111.1 R125.1), DAC_LED_Monitor (U1.13)
CPU_D6: DAC_CPU (R113.1 R127.1), DAC_LED_Monitor (U1.15)
CPU_D7: DAC_CPU (R114.1 R129.1), DAC_LED_Monitor (U1.17)
CPU_nInt: DAC_CPU (R105.2 R141.2), DAC_LED_Monitor (R92.1)
CPU_Reset: DAC_CPU (R112.2 R118.2), DAC_LED_Monitor (R93.1)
CPU_RnW: DAC_CPU (R108.2 R140.2), DAC_LED_Monitor (R69.1 R70.1)
DAC_CS_0: DAC_IO (R33.1), DAC_CPU (R132.1), DAC_LED_Monitor (R95.1)
DAC_CS_1: DAC_IO (R43.1), DAC_CPU (R134.1), DAC_LED_Monitor (R96.1)
DAC_CS_2: DAC_IO (R34.1), DAC_CPU (R136.1), DAC_LED_Monitor (R97.1)
DAC_CS_3: DAC_IO (R47.1), DAC_CPU (R138.1), DAC_LED_Monitor (R98.1)
DAC_Din: DAC_IO (R29.1 R31.1 R40.1 R44.1), DAC_CPU (R135.2), DAC_LED_Monitor (R82.1)
DAC_SCLK: DAC_IO (R35.1 R36.1 R46.1 R48.1), DAC_CPU (R137.2), DAC_LED_Monitor (R83.1)